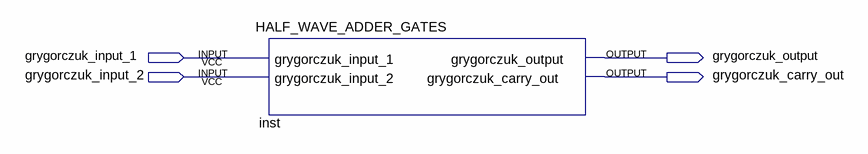
[diagram p0: schematic sheet]
// Quartus schematic HALF_WAVE_ADDER_SYMBOL.bdf as structural Verilog: 1 symbols, 4 pins
module HALF_WAVE_ADDER_SYMBOL (
  input  grygorczuk_input_1,
  input  grygorczuk_input_2,
  output grygorczuk_output,
  output grygorczuk_carry_out
);

  HALF_WAVE_ADDER_GATES inst (
    .grygorczuk_input_1(grygorczuk_input_1), .grygorczuk_input_2(grygorczuk_input_2),
    .grygorczuk_output(grygorczuk_output), .grygorczuk_carry_out(grygorczuk_carry_out));
endmodule
